# Altium schematic sheet RF Waveform Generator Schematic.SchDoc
size OrCAD D; SheetNumber: 1; SheetTotal: 1
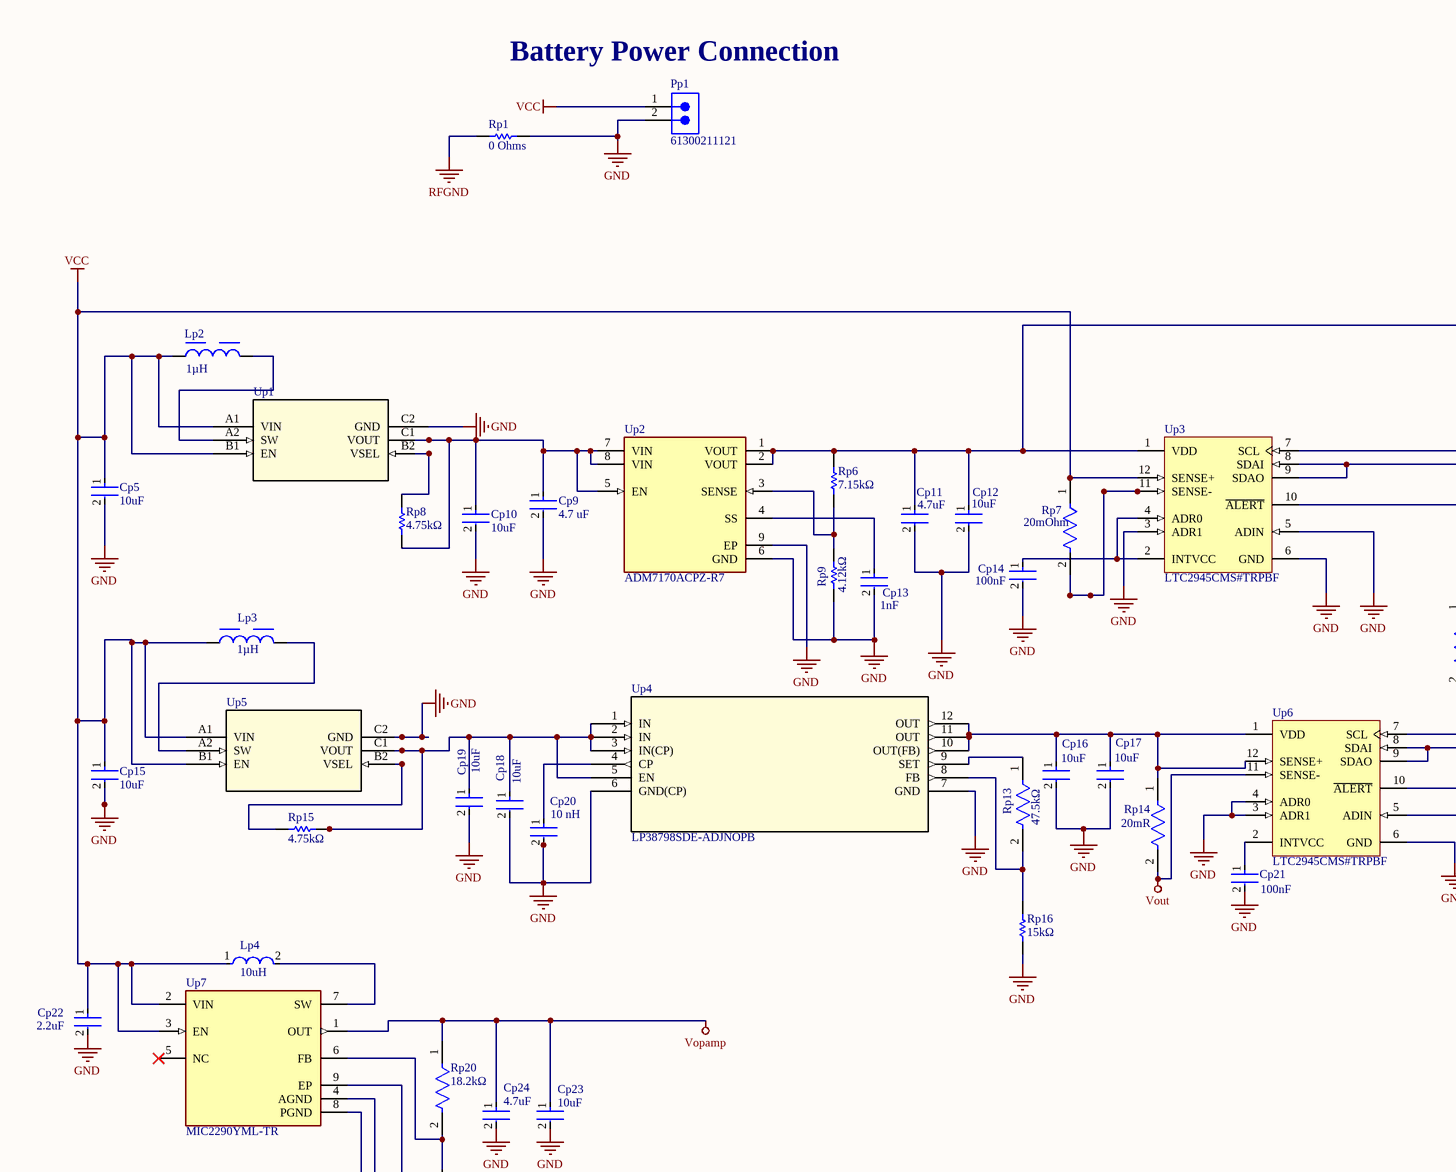
[diagram p0: RF Waveform Generator Schematic.SchDoc, top left]
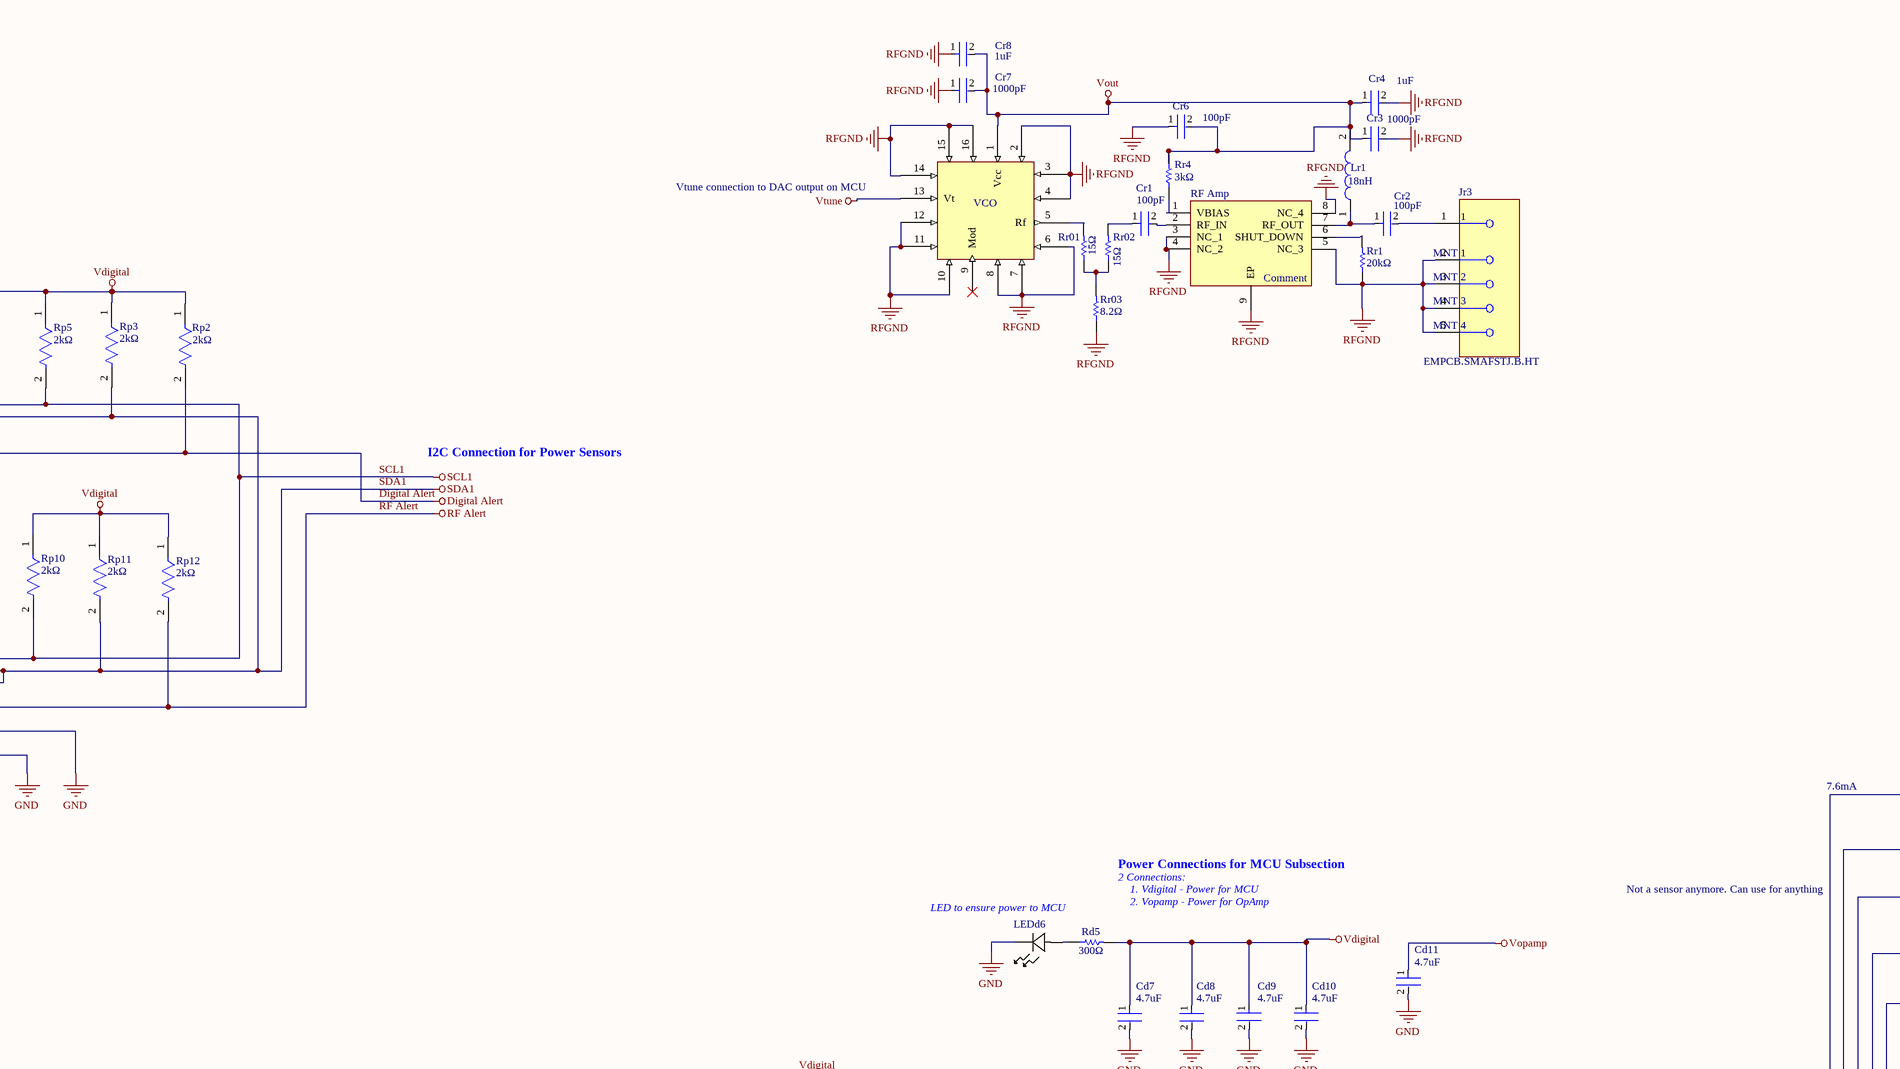
[diagram p1: RF Waveform Generator Schematic.SchDoc, top middle]
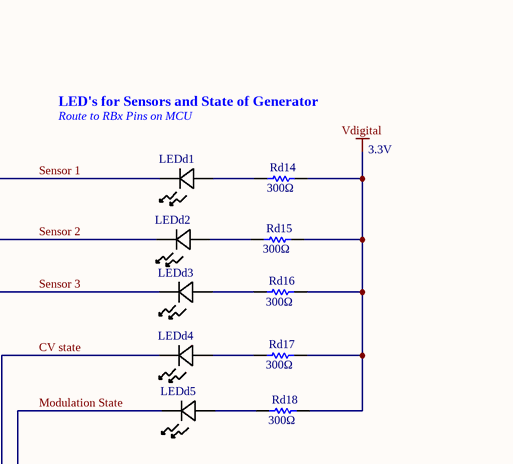
[diagram p2: RF Waveform Generator Schematic.SchDoc, top right]
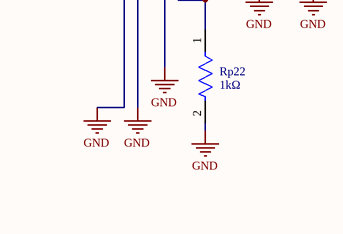
[diagram p3: RF Waveform Generator Schematic.SchDoc, bottom left]
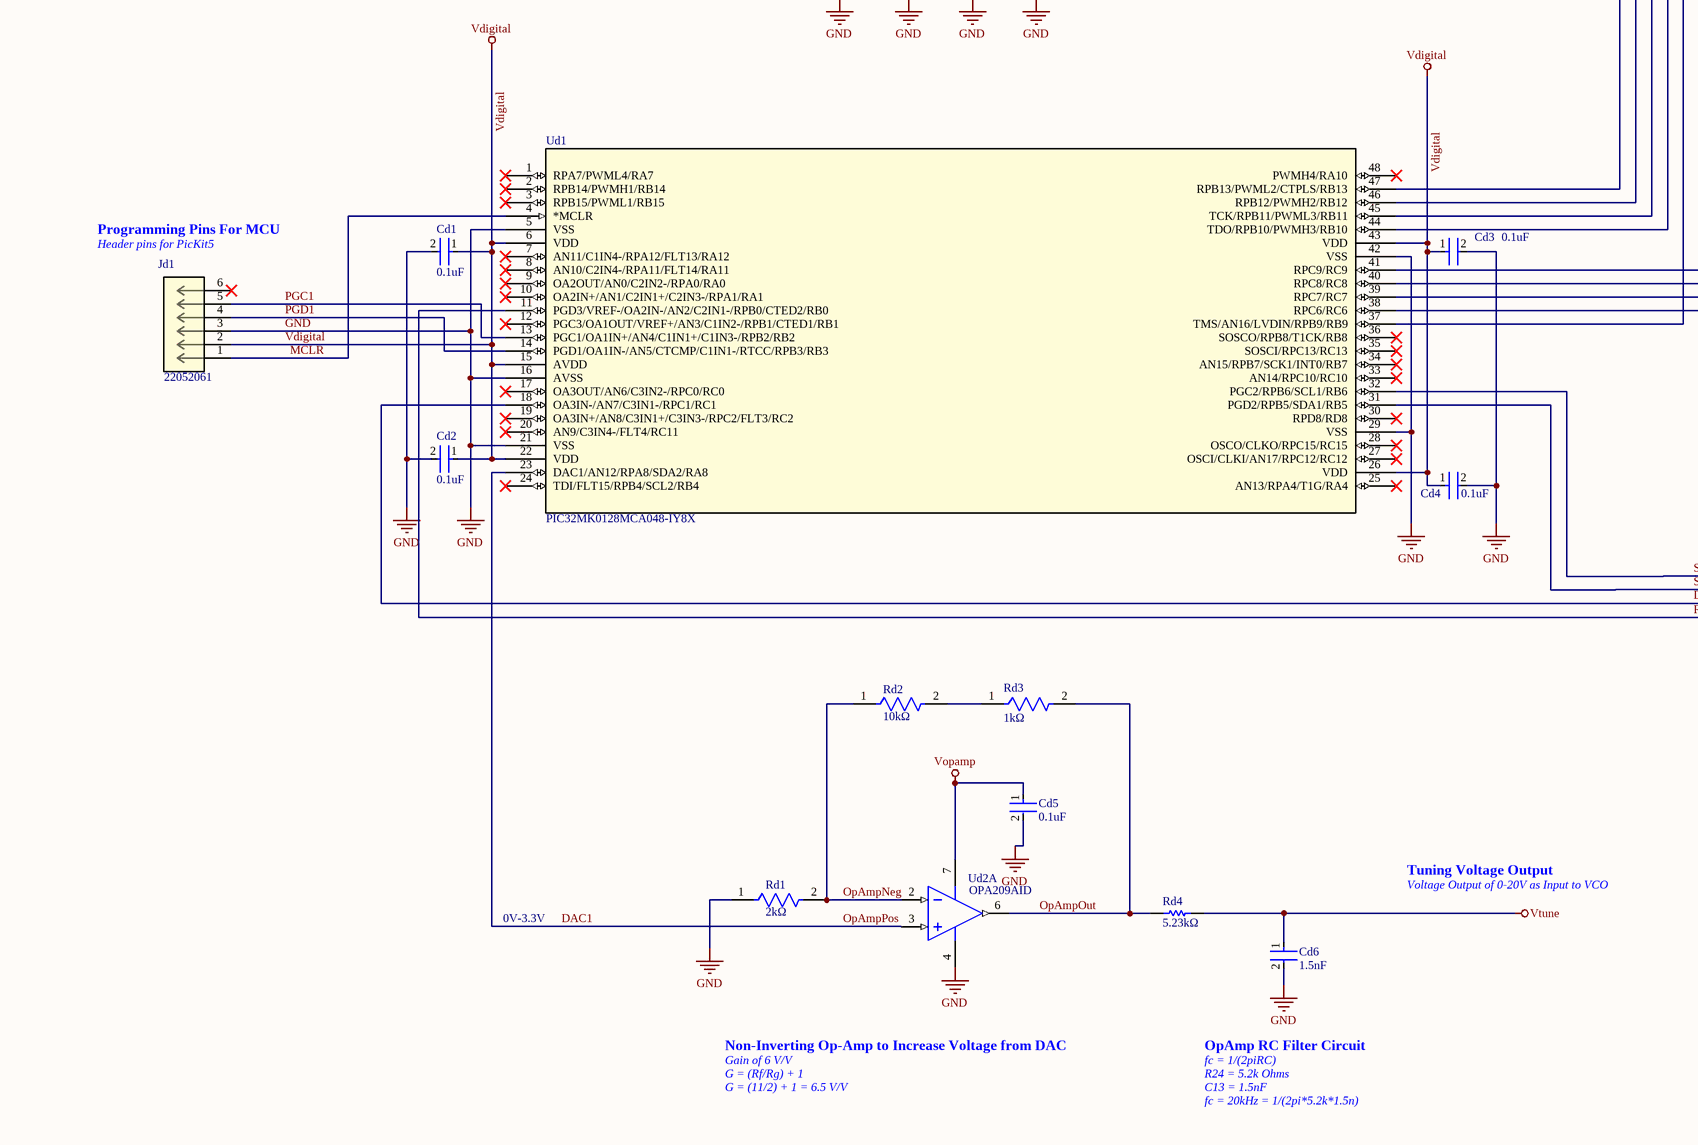
[diagram p4: RF Waveform Generator Schematic.SchDoc, bottom middle]
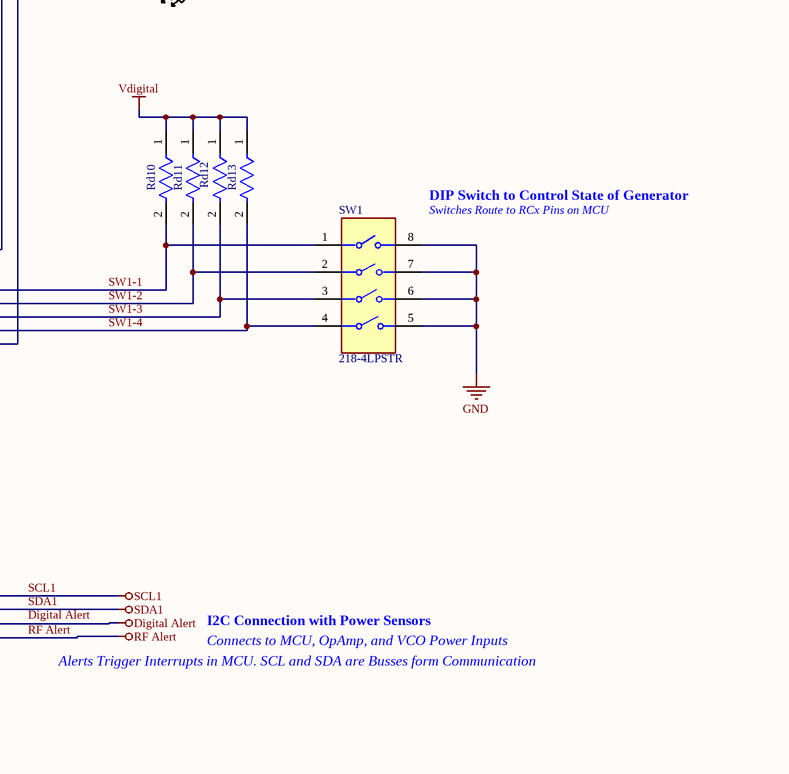
[diagram p5: RF Waveform Generator Schematic.SchDoc, bottom right]

## Parts
1  VCO  [VCO]
?  Component_1  (value not drawn)
Cd1  0.1uF  [FP-CC0402-MFG]
Cd2  0.1uF  [FP-CC0402-MFG]
Cd3  0.1uF  [FP-CC0402-MFG]
Cd4  0.1uF  [FP-CC0402-MFG]
Cd5  0.1uF  [FP-CC0402-MFG]
Cd6  1.5nF  [FP-CGA3E-0_3-0_1-MFG]
Cd7  4.7uF  [FP-GRM188-0_2-IPC_C]
Cd8  4.7uF  [FP-GRM188-0_2-IPC_C]
Cd9  4.7uF  [FP-GRM188-0_2-IPC_C]
Cd10  4.7uF  [FP-GRM188-0_2-IPC_C]
Cd11  4.7uF  [FP-GRM188-0_2-IPC_C]
Cp5  10uF  [FP-GRM188-0_2-IPC_C]
Cp9  4.7 uF  [FP-GRM188-0_2-IPC_A]
Cp10  10uF  [FP-GRM188-0_2-IPC_C]
Cp11  4.7uF  [FP-GRM188-0_2-IPC_A]
Cp12  10uF  [FP-GRM188-0_2-IPC_C]
Cp13  value 1nF  [FP-CC0402-MFG]  (hidden comment: CC0402KRX7R7BB102)
Cp14  Capacitance: 100nF  [FP-CC0402-MFG]  (hidden comment: CC0402KRX7R7BB104)
Cp15  10uF  [FP-GRM188-0_2-IPC_C]
Cp16  10uF  [FP-GRM188-0_2-IPC_C]
Cp17  10uF  [FP-GRM188-0_2-IPC_C]
Cp18  10uF  [FP-GRM188-0_2-IPC_C]
Cp19  10uF  [FP-GRM188-0_2-IPC_C]
Cp20  value 10 nH  [FP-C0402-BB-MFG]  (hidden comment: C0402C103K4RACTU)
Cp21  Capacitance: 100nF  [FP-CC0402-MFG]  (hidden comment: CC0402KRX7R7BB104)
Cp22  Capacitance: 2.2uF  [FP-GRM155-0_1-MFG]  (hidden comment: GRM155R61C225ME44D)
Cp23  10uF  [FP-GRM188-0_2-IPC_C]
Cp24  4.7uF  [FP-GRM188-0_2-IPC_A]
Cr1  100pF  [FP-C0402-BB-MFG]
Cr2  100pF  [FP-C0402-BB-MFG]
Cr3  1000pF  [FP-CC0402-MFG]
Cr4  1uF  [FP-CC0402-MFG]
Cr6  100pF  [FP-C0402-BB-MFG]
Cr7  1000pF  [FP-CC0402-MFG]
Cr8  1uF  [FP-CC0402-MFG]
Jd1  22052061  [CONN_22-05-2061_MOL]
Jr3  EMPCB.SMAFSTJ.B.HT  [FP-EMPCB_SMAFSTJ_B_HT-MFG]
LEDd1  XZCDGK54W-1VF  [LED_XZCDGK54W-1VF_SLD]  (value not drawn)
LEDd2  XZCDGK54W-1VF  [LED_XZCDGK54W-1VF_SLD]  (value not drawn)
LEDd3  XZCDGK54W-1VF  [LED_XZCDGK54W-1VF_SLD]  (value not drawn)
LEDd4  XZCDGK54W-1VF  [LED_XZCDGK54W-1VF_SLD]  (value not drawn)
LEDd5  XZCDGK54W-1VF  [LED_XZCDGK54W-1VF_SLD]  (value not drawn)
LEDd6  XZCDGK54W-1VF  [LED_XZCDGK54W-1VF_SLD]  (value not drawn)
Lp2  Inductance: 1µH  [WE-MAPI_2510]  (hidden comment: 74438323010)
Lp3  Inductance: 1µH  [WE-MAPI_2510]  (hidden comment: 74438323010)
Lp4  Inductance: 10uH  [FP-MLZ2012-1_25-MFG]  (hidden comment: MLZ2012N100LT000)
Lr1  18nH  [0603CS82NXGLW]
Pp1  61300211121  [61300211121]
Rd1  2kΩ  [FP-RC_L0402-MFG]
Rd2  10kΩ  [FP-AC0402-MFG]
Rd3  Resistance: 1kΩ  [FP-RC0402-0_4-IPC_A]  (hidden comment: RC0402FR-071KL)
Rd4  5.23kΩ  [RESC1005X40X25NL05T10]
Rd5  300Ω  [RESC1005X40X25LL05T10]
Rd10  AC0402FR-0710KL  [FP-AC0402-MFG]  (value not drawn)
Rd11  AC0402FR-0710KL  [FP-AC0402-MFG]  (value not drawn)
Rd12  AC0402FR-0710KL  [FP-AC0402-MFG]  (value not drawn)
Rd13  AC0402FR-0710KL  [FP-AC0402-MFG]  (value not drawn)
Rd14  300Ω  [RESC1005X40X25LL05T10]
Rd15  300Ω  [RESC1005X40X25LL05T10]
Rd16  300Ω  [RESC1005X40X25LL05T10]
Rd17  300Ω  [RESC1005X40X25LL05T10]
Rd18  300Ω  [RESC1005X40X25LL05T10]
RF_Amp  Comment
Rp1  0 Ohms  [RESC1005X40X25NL05T10]
Rp2  Resistance: 2kΩ  [FP-RC_L0402-MFG]  (hidden comment: RC0402FR-072KL)
Rp3  Resistance: 2kΩ  [FP-RC_L0402-MFG]  (hidden comment: RC0402FR-072KL)
Rp5  Resistance: 2kΩ  [FP-RC_L0402-MFG]  (hidden comment: RC0402FR-072KL)
Rp6  7.15kΩ  [RESC1005X40X25ML05T10]
Rp7  Resistance: 20mOhm  [FP-PE0402-0_5-MFG]  (hidden comment: PE0402JRF070R02L)
Rp8  4.75kΩ  [RESC1005X40X25LL05T10]
Rp9  4.12kΩ  [RESC1005X40X25ML05T10]
Rp10  Resistance: 2kΩ  [FP-RC_L0402-MFG]  (hidden comment: RC0402FR-072KL)
Rp11  Resistance: 2kΩ  [FP-RC_L0402-MFG]  (hidden comment: RC0402FR-072KL)
Rp12  Resistance: 2kΩ  [FP-RC_L0402-MFG]  (hidden comment: RC0402FR-072KL)
Rp13  Resistance: 47.5kΩ  [FP-RT0402-MFG]  (hidden comment: RT0402CRD0747K5L)
Rp14  Resistance: 20mR  [FP-PE0402-0_5-MFG]  (hidden comment: PE0402JRF070R02L)
Rp15  4.75kΩ  [RESC1005X40X25LL05T10]
Rp16  15kΩ  [RESC1005X40X25NL05T10]
Rp20  value 18.2kΩ  [FP-RT0402-MFG]  (hidden comment: RT0402DRE0718K2L)
Rp22  Resistance: 1kΩ  [FP-RC0402-0_4-IPC_A]  (hidden comment: RC0402FR-071KL)
Rr1  20kΩ  [RESC1005X40X25NL05T10]
Rr01  15Ω  [RESC1005X40X25LL05T10]
Rr02  15Ω  [RESC1005X40X25LL05T10]
Rr03  8.2Ω  [RESC1005X40X25LL05T10]
Rr4  3kΩ  [RESC1005X40X25LL10T10]
SW1  218-4LPSTR  [FP-218-4LPSTR-MFG]
Ud1  PIC32MK0128MCA048-IY8X  [TQFP48_Y8X_MCH]
Ud2  OPA209AID  [D0008A_N]  (part A of 2)
Up1  TPS61299YBHR  [Boost]  (value not drawn)
Up2  ADM7170ACPZ-R7  [FP-CP-8-21-IPC_C]
Up3  LTC2945CMS#TRPBF  [LT-MS-12_N]
Up4  LP38798SDE-ADJNOPB  [LDO]
Up5  TPS61299YBHR  [Boost]  (value not drawn)
Up6  LTC2945CMS#TRPBF  [LT-MS-12_N]
Up7  MIC2290YML-TR  [FP-DFN22-8LD-PL-1-IPC_A]

## Nets
Digital Alert: Rp2.2 Ud1.18(OA3IN-/AN7/C3IN1-/RPC1/RC1) Up3.10(~{ALERT})
GND: Cd1.2 Cd2.2 Cd3.2 Cd4.2 Cd5.2 Cd6.2 Cd7.2 Cd8.2 Cd9.2 Cd10.2 Cd11.2 Cp5.2 Cp9.2 Cp10.2 Cp11.2 Cp12.2 Cp13.2 Cp14.2 Cp15.2 Cp16.2 Cp17.2 Cp18.2 Cp19.2 Cp20.2 Cp21.2 Cp22.2 Cp23.2 Cp24.2 Jd1.3 LEDd6.1(CATHODE) Pp1.2 Rd1.1 Rp1.2 Rp9.1 Rp16.2 Rp22.2 SW1.5 SW1.6 SW1.7 SW1.8 Ud1.5(VSS) Ud1.16(AVSS) Ud1.21(VSS) Ud1.29(VSS) Ud1.42(VSS) Ud2.4(V-) Up1.C2(GND) Up2.6(GND) Up2.9(EP) Up3.3(ADR1) Up3.5(ADIN) Up3.6(GND) Up4.6(GND(CP)) Up4.7(GND) Up5.C2(GND) Up6.3(ADR1) Up6.4(ADR0) Up6.5(ADIN) Up6.6(GND) Up7.4(AGND) Up7.8(PGND) Up7.9(EP)
RF Alert: Rp12.2 Ud1.11(PGD3/VREF-/OA2IN-/AN2/C2IN1-/RPB0/CTED2/RB0) Up6.10(~{ALERT})
RFGND: 1.2 1.3 1.4 1.6 1.7 1.8 1.10 1.11 1.12 1.14 1.15 1.16 Cr3.2 Cr4.2 Cr6.1 Cr7.1 Cr8.1 Jr3.2(MNT_1) Jr3.3(MNT_2) Jr3.4(MNT_3) Jr3.5(MNT_4) RF_Amp.3(NC_1) RF_Amp.4(NC_2) RF_Amp.5(NC_3) RF_Amp.8(NC_4) RF_Amp.9(EP) Rp1.1 Rr1.1 Rr03.1
SCL1: Rp5.2 Rp10.2 Ud1.32(PGC2/RPB6/SCL1/RB6) Up3.7(SCL) Up6.7(SCL)
SDA1: Rp3.2 Rp11.2 Ud1.31(PGD2/RPB5/SDA1/RB5) Up3.8(SDAI) Up3.9(SDAO) Up6.8(SDAI) Up6.9(SDAO)
VCC: Cp5.1 Cp15.1 Cp22.1 Lp2.1 Lp3.1 Lp4.1 Pp1.1 Rp7.1 Up1.A1(VIN) Up1.B1(EN) Up3.12(SENSE+) Up5.A1(VIN) Up5.B1(EN) Up7.2(VIN) Up7.3(EN)
Vdigital: Cd1.1 Cd2.1 Cd3.1 Cd4.1 Cd7.1 Cd8.1 Cd9.1 Cd10.1 Cp11.1 Cp12.1 Jd1.2 Rd5.2 Rd10.1 Rd11.1 Rd12.1 Rd13.1 Rd14.2 Rd15.2 Rd16.2 Rd17.2 Rd18.2 Rp2.1 Rp3.1 Rp5.1 Rp6.2 Rp10.1 Rp11.1 Rp12.1 Ud1.6(VDD) Ud1.15(AVDD) Ud1.22(VDD) Ud1.26(VDD) Ud1.43(VDD) Up2.1(VOUT) Up2.2(VOUT) Up3.1(VDD)
Vopamp: Cd5.1 Cd11.1 Cp23.1 Cp24.1 Rp20.1 Ud2.7(V+) Up7.1(OUT)
Vout: 1.1(Vcc) Cr3.1 Cr4.1 Cr6.2 Cr7.2 Cr8.2 Lr1.2 Rp14.2 Rr4.2 Up6.11(SENSE-)
Vtune: 1.13(Vt) Cd6.1 Rd4.2
CV state: LEDd4.1(CATHODE) Ud1.44(TDO/RPB10/PWMH3/RB10)
DAC1: Ud1.23(DAC1/AN12/RPA8/SDA2/RA8) Ud2.3(IN+)  [also labelled OpAmpPos]
MCLR: Jd1.1 Ud1.4(*MCLR)
Modulation State: LEDd5.1(CATHODE) Ud1.37(TMS/AN16/LVDIN/RPB9/RB9)
OpAmpNeg: Rd1.2 Rd2.1 Ud2.2(IN-)
OpAmpOut: Rd3.2 Rd4.1 Ud2.6(OUT)
PGC1: Jd1.5 Ud1.13(PGC1/OA1IN+/AN4/C1IN1+/C1IN3-/RPB2/RB2)
PGD1: Jd1.4 Ud1.14(PGD1/OA1IN-/AN5/CTCMP/C1IN1-/RTCC/RPB3/RB3)
Sensor 1: LEDd1.1(CATHODE) Ud1.47(RPB13/PWML2/CTPLS/RB13)
Sensor 2: LEDd2.1(CATHODE) Ud1.46(RPB12/PWMH2/RB12)
Sensor 3: LEDd3.1(CATHODE) Ud1.45(TCK/RPB11/PWML3/RB11)
SW1-1: Rd10.2 SW1.1 Ud1.41(RPC9/RC9)
SW1-2: Rd11.2 SW1.2 Ud1.40(RPC8/RC8)
SW1-3: Rd12.2 SW1.3 Ud1.39(RPC7/RC7)
SW1-4: Rd13.2 SW1.4 Ud1.38(RPC6/RC6)
Net1_5: 1.5(Rf) Rr01.2
NetCp9_1: Cp9.1 Cp10.1 Rp8.2 Up1.C1(VOUT) Up2.5(EN) Up2.7(VIN) Up2.8(VIN)
NetCp13_1: Cp13.1 Up2.4(SS)
NetCp14_1: Cp14.1 Up3.2(INTVCC) Up3.4(ADR0)
NetCp16_1: Cp16.1 Cp17.1 Rp14.1 Up4.10(OUT(FB)) Up4.11(OUT) Up4.12(OUT) Up6.1(VDD) Up6.12(SENSE+)
NetCp18_1: Cp18.1 Cp19.1 Rp15.2 Up4.1(IN) Up4.2(IN) Up4.3(IN(CP)) Up4.5(EN) Up5.C1(VOUT)
NetCp20_1: Cp20.1 Up4.4(CP)
NetCp21_1: Cp21.1 Up6.2(INTVCC)
NetCr1_1: Cr1.1 Rr02.2
NetCr1_2: Cr1.2 RF_Amp.2(RF_IN)
NetCr2_1: Cr2.1 Lr1.1 RF_Amp.7(RF_OUT)
NetCr2_2: Cr2.2 Jr3.1
NetLEDd1_2: LEDd1.2(ANODE) Rd14.1
NetLEDd2_2: LEDd2.2(ANODE) Rd15.1
NetLEDd3_2: LEDd3.2(ANODE) Rd16.1
NetLEDd4_2: LEDd4.2(ANODE) Rd17.1
NetLEDd5_2: LEDd5.2(ANODE) Rd18.1
NetLEDd6_2: LEDd6.2(ANODE) Rd5.1
NetLp2_2: Lp2.2 Up1.A2(SW)
NetLp3_2: Lp3.2 Up5.A2(SW)
NetLp4_2: Lp4.2 Up7.7(SW)
NetRd2_2: Rd2.2 Rd3.1
NetRF_Amp_1: RF_Amp.1(VBIAS) Rr4.1
NetRF_Amp_6: RF_Amp.6(SHUT_DOWN) Rr1.2
NetRp6_1: Rp6.1 Rp9.2 Up2.3(SENSE)
NetRp7_2: Rp7.2 Up3.11(SENSE-)
NetRp8_1: Rp8.1 Up1.B2(VSEL)
NetRp13_1: Rp13.1 Up4.9(SET)
NetRp13_2: Rp13.2 Rp16.1 Up4.8(FB)
NetRp15_1: Rp15.1 Up5.B2(VSEL)
NetRp20_2: Rp20.2 Rp22.1 Up7.6(FB)
NetRr01_1: Rr01.1 Rr02.1 Rr03.2

Not connected (* = marked no-connect by the designer): 1 9(Mod)*; Jd1 6*; Ud1 1(RPA7/PWML4/RA7)* 2(RPB14/PWMH1/RB14)* 3(RPB15/PWML1/RB15)* 7(AN11/C1IN4-/RPA12/FLT13/RA12)* 8(AN10/C2IN4-/RPA11/FLT14/RA11)* 9(OA2OUT/AN0/C2IN2-/RPA0/RA0)* 10(OA2IN+/AN1/C2IN1+/C2IN3-/RPA1/RA1)* 12(PGC3/OA1OUT/VREF+/AN3/C1IN2-/RPB1/CTED1/RB1)* 17(OA3OUT/AN6/C3IN2-/RPC0/RC0)* 19(OA3IN+/AN8/C3IN1+/C3IN3-/RPC2/FLT3/RC2)* 20(AN9/C3IN4-/FLT4/RC11)* 24(TDI/FLT15/RPB4/SCL2/RB4)* 25(AN13/RPA4/T1G/RA4)* 27(OSCI/CLKI/AN17/RPC12/RC12)* 28(OSCO/CLKO/RPC15/RC15)* 30(RPD8/RD8)* 33(AN14/RPC10/RC10)* 34(AN15/RPB7/SCK1/INT0/RB7)* 35(SOSCI/RPC13/RC13)* 36(SOSCO/RPB8/T1CK/RB8)* 48(PWMH4/RA10)*; Up7 5(NC)*

## Notes on the sheet
- (near Pp1) Battery Power Connection
- Vtune connection to DAC output on MCU
- I2C Connection for Power Sensors
- Route to RBx Pins on MCU
- LED's for Sensors and State of Generator
- 3.3V
- 7.6mA
- 2 Connections:
- Power Connections for MCU Subsection
- 1. Vdigital - Power for MCU
- (near Rd5) 2. Vopamp - Power for OpAmp
- Not a sensor anymore. Can use for anything
- LED to ensure power to MCU
- (near SW1) DIP Switch to Control State of Generator
- (near Jd1) Programming Pins For MCU
- (near Jd1) Header pins for PicKit5
- (near SW1) Switches Route to RCx Pins on MCU
- Alerts Trigger Interrupts in MCU. SCL and SDA are Busses form Communication
- I2C Connection with Power Sensors
- Connects to MCU, OpAmp, and VCO Power Inputs
- 0V-3.3V
- Tuning Voltage Output
- Voltage Output of 0-20V as Input to VCO
- Non-Inverting Op-Amp to Increase Voltage from DAC
- Gain of 6 V/V
- fc = 1/(2piRC)
- OpAmp RC Filter Circuit
- G = (Rf/Rg) + 1
- G = (11/2) + 1 = 6.5 V/V
- fc = 20kHz = 1/(2pi*5.2k*1.5n)
- R24 = 5.2k Ohms
- C13 = 1.5nF
- Labels drawn without touching a wire or pin: Digital Alert

## Library data of the parts
Cd1-Cd5 = CMP-03422-000048-1: CC0402KRX7R7BB104, CAP CER 0.1UF 16V X7R 0402; Manufacturer: YAGEO; Automotive Grade: NA; Capacitance: 100 nF; Temperature Coefficient: 30ppm/°C; Tolerance: 0.1; Value: 100 nF; Device Class L1: Passive Components; Material: Ceramic; Temperature Range Low: -55°C; Device Class L3: Ceramic Capacitors; Temperature Characteristic: X7R; Ipc Land Pattern Name: CAPC10050X50; Temperature Range High: +125°C; Voltage Rating: 16 V; Temperature: -55°C to +125°C; RoHS: TRUE; Automotive: No; Height: 0.55mm; Device Class L2: Capacitors; Digikey Description: CAP CER 0.1UF 16V X7R 0402; Package: CC0402; Footprint Url: http://www.yageo.com/exep/pages/download/literatures/UPY-C_GEN_24.pdf; ComponentLink2Description: Datasheet; Category: Cap; Lead Free: Yes; Octopart: https://octopart.com/cc0402krx7r7bb104-yageo-42244624; ComponentLink2URL: http://www.yageo.com/documents/recent/UPY-GP_NP0_16V-to-50V_16.pdf; Manufacturer Part Number: CC0402KRX7R7BB104; Mouser Description: 0402 0.1 uF 16 V ±10 % Tolerance X7R SMT Multilayer Ceramic Capacitor
Cd6 = CMP-08246-001593-1: CGA3E2X5R1H152K080AA / Cap Ceramic 1.5nF 50V X5R 10% Pad SMD 0603 +85°C Automotive T/R; Case/Package: 0603; Capacitance: 1.5nF; Width: 0.031inch; Termination: SMD/SMT; Dielectric: X5R; Ratings: AEC-Q200; Package Quantity: 4000; Min Operating Temperature: -55°C; Case Code (Metric): 1608; Tolerance: 10%; Voltage Rating: 50V; Height: 0.8mm; Case Code (Imperial): 0603; Max Operating Temperature: 85°C; Length: 0.063inch; Packaging: Tape and Reel; Mount: Surface Mount; Weight: 7.1E-05oz; Thickness: 0.035inch; Voltage Rating (DC): 50V
Cd7-Cd11 = CMP-2006-02545-2: Chip Multilayer Ceramic Capacitors for General Purpose, 0603, 4.7uF, X5R, 15%, 10%, 35V; Lead Free: Lead Free; Max Operating Temperature: 85°C; Case Code (Imperial): 0603; Capacitance: 4.7uF; Width: 0.8mm; Thickness: 0.031inch; Case Code (Metric): 1608; Min Operating Temperature: -55°C; Voltage Rating (DC): 35V; Dielectric: X5R; Voltage: 35V; Packaging: Tape and Reel; Resistor Type: Ceramic; Weight: 0.000222oz; Mount: Surface Mount; Material: Ceramic; Depth: 0.8mm; Tolerance: 10%; REACH SVHC: No SVHC; Case/Package: 0603; Voltage Rating: 35V; Package Quantity: 4000; Height: 0.8mm; Length: 1.6mm; Termination: SMD/SMT
Cp5 Cp10 Cp12 Cp15-Cp19 Cp23 = CMP-06035-000049-2: Chip Multilayer Ceramic Capacitors for General Purpose, 0603, 10uF, X7R, 15%, 10%, 10V
Cp9 Cp11 Cp24 = CMP-06035-045467-1: Chip Multilayer Ceramic Capacitors for General Purpose, 0603, 4.7uF, X7R, 15%, 10%, 16V
Cp13 = CMP-2000-06070-2: CAP CER 1000PF 16V X7R 0402; Manufacturer: YAGEO; Tolerance: 0.1; Temperature Coefficient: 30ppm/°C; Automotive Grade: NA; Capacitance: 1.0 nF; Manufacturer Part Number: CC0402KRX7R7BB102; Automotive: No; ComponentLink2Description: Datasheet; Voltage Rating: 16 V; ComponentLink2URL: http://www.yageo.com/documents/recent/UPY-GP_NP0_16V-to-50V_16.pdf; Device Class L1: Passive Components; Lead Free: Yes; Temperature Range Low: -55°C; Package: CC0402; Ipc Land Pattern Name: CAPC10050X50; Mouser Description: 0402 1 nF 16 V ±10 % Tolerance X7R SMT Multilayer Ceramic Capacitor; Footprint Url: http://www.yageo.com/exep/pages/download/literatures/UPY-C_GEN_24.pdf; Temperature Range High: +125°C; Material: Ceramic; Category: Cap; Temperature: -55°C to +125°C; Octopart: https://octopart.com/cc0402krx7r7bb102-yageo-11543552; RoHS: TRUE; Device Class L3: Ceramic Capacitors; Height: 0.55mm; Device Class L2: Capacitors; Temperature Characteristic: X7R; Digikey Description: CAP CER 1000PF 16V X7R 0402
Cp14 Cp21 = CMP-03422-000048-1: CAP CER 0.1UF 16V X7R 0402; Manufacturer: YAGEO; Automotive Grade: NA; Temperature Coefficient: 30ppm/°C; Tolerance: 0.1; Value: 100 nF; Device Class L1: Passive Components; Material: Ceramic; Temperature Range Low: -55°C; Device Class L3: Ceramic Capacitors; Temperature Characteristic: X7R; Ipc Land Pattern Name: CAPC10050X50; Temperature Range High: +125°C; Voltage Rating: 16 V; Temperature: -55°C to +125°C; RoHS: TRUE; Automotive: No; Height: 0.55mm; Device Class L2: Capacitors; Digikey Description: CAP CER 0.1UF 16V X7R 0402; Package: CC0402; Footprint Url: http://www.yageo.com/exep/pages/download/literatures/UPY-C_GEN_24.pdf; ComponentLink2Description: Datasheet; Category: Cap; Lead Free: Yes; Octopart: https://octopart.com/cc0402krx7r7bb104-yageo-42244624; ComponentLink2URL: http://www.yageo.com/documents/recent/UPY-GP_NP0_16V-to-50V_16.pdf; Manufacturer Part Number: CC0402KRX7R7BB104; Mouser Description: 0402 0.1 uF 16 V ±10 % Tolerance X7R SMT Multilayer Ceramic Capacitor
Cp20 = CMP-2008-03072-2: CAP CER 10000PF 16V X7R 0402; Manufacturer: Kemet; Tolerance: 0.1; Capacitance: 10,000 pF; Temperature Coefficient: 15%; Package: C0402-BB; Height: 0.55mm; Temperature Range Low: -55°C; Lead Free: Yes; Material: Ceramic; Mouser Description: Capacitor; Ceramic; Cap; .010uF; Tol 10%; SMT; Vol-Rtg 16V; X7R; Tape and Reel; RoHS: TRUE; Device Class L3: Ceramic Capacitors; Voltage Rating: 16 V; Automotive: No; Temperature: -55°C to +125°C; Digikey Description: CAP CER 10000PF 16V X7R 0402; Temperature Characteristic: X7R; Temperature Range High: +125°C; Category: Cap; Ipc Land Pattern Name: CAPC10050X50; ComponentLink2URL: https://content.kemet.com/datasheets/KEM_C1002_X7R_SMD.pdf; Manufacturer Part Number: C0402C103K4RACTU; Octopart: https://octopart.com/c0402c103k4ractu-kemet-130896; ComponentLink2Description: Datasheet; Device Class L1: Passive Components; Device Class L2: Capacitors
Cp22 = CMP-06035-058929-1: Chip Multilayer Ceramic Capacitors for General Purpose, 0402, 2.2uF, X5R, 15%, 20%, 16V; Case/Package: 0402; Min Operating Temperature: -55°C; Tolerance: 20%; Width: 0.02inch; Height: 0.5mm; Package Quantity: 10000; Voltage Rating: 16V; Termination: SMD/SMT; Thickness: 0.024inch; Voltage Rating (DC): 16V; Weight: 0.000212oz; Max Operating Temperature: 85°C; Dielectric: X5R; Length: 0.039inch; Mount: Surface Mount; Case Code (Metric): 1005; Case Code (Imperial): 0402; Packaging: Tape and Reel
Cr1 Cr2 Cr6 = CMP-2008-03284-2: C0402C101J5GACTU, CAP CER 100PF 50V C0G/NP0 0402; Manufacturer: Kemet; Tolerance: 0.05; Temperature Characteristic: C0G; Temperature Coefficient: 15%; Material: Ceramic; Digikey Description: CAP CER 100PF 50V C0G/NP0 0402; Lead Free: Yes; Capacitance: 100 pF; Device Class L3: Ceramic Capacitors; Mouser Description: Multilayer Ceramic Capacitors MLCC - SMD/SMT 50volts 100pF C0G 5%; Octopart: https://octopart.com/c0402c101j5gactu-kemet-132471; Temperature Range Low: -55°C; Value: 100 pF; Automotive: No; Height: 0.55mm; Category: Cap; ComponentLink2URL: https://content.kemet.com/datasheets/KEM_C1002_X7R_SMD.pdf; Manufacturer Part Number: C0402C101J5GACTU; RoHS: TRUE; Ipc Land Pattern Name: CAPC10050X50; Temperature Range High: +125°C; Device Class L2: Capacitors; Package: C0402-BB; ComponentLink2Description: Datasheet; Temperature: -55°C to +125°C; Voltage Rating: 50 V; Device Class L1: Passive Components
Cr3 Cr7 = CMP-2000-06070-2: CC0402KRX7R7BB102, CAP CER 1000PF 16V X7R 0402; Manufacturer: YAGEO; Value: 1.0 nF; Tolerance: 0.1; Temperature Coefficient: 30ppm/°C; Automotive Grade: NA; Material: Ceramic; Manufacturer Part Number: CC0402KRX7R7BB102; Automotive: No; ComponentLink2Description: Datasheet; Voltage Rating: 16 V; ComponentLink2URL: http://www.yageo.com/documents/recent/UPY-GP_NP0_16V-to-50V_16.pdf; Device Class L1: Passive Components; Lead Free: Yes; Temperature Range Low: -55°C; Package: CC0402; Ipc Land Pattern Name: CAPC10050X50; Mouser Description: 0402 1 nF 16 V ±10 % Tolerance X7R SMT Multilayer Ceramic Capacitor; Footprint Url: http://www.yageo.com/exep/pages/download/literatures/UPY-C_GEN_24.pdf; Temperature Range High: +125°C; Category: Cap; Temperature: -55°C to +125°C; Octopart: https://octopart.com/cc0402krx7r7bb102-yageo-11543552; RoHS: TRUE; Capacitance: 1.0 nF; Device Class L3: Ceramic Capacitors; Height: 0.55mm; Device Class L2: Capacitors; Temperature Characteristic: X7R; Digikey Description: CAP CER 1000PF 16V X7R 0402
Cr4 Cr8 = CMP-03422-000489-1: CC0402KRX5R6BB105, CAP CER 1UF 10V X5R 0402; Manufacturer: YAGEO; Temperature Coefficient: 30ppm/°C; Tolerance: 0.1; Automotive Grade: NA; Material: Ceramic; Device Class L1: Passive Components; Ipc Land Pattern Name: CAPC10050X50; Height: 0.55mm; Voltage Rating: 10 V; Digikey Description: CAP CER 1UF 10V X5R 0402; RoHS: TRUE; Temperature: -55°C to +125°C; Octopart: https://octopart.com/cc0402krx5r6bb105-yageo-42244620; Mouser Description: Multilayer Ceramic Capacitors MLCC - SMD/SMT 1uF 10V X5R 10%; Manufacturer Part Number: CC0402KRX5R6BB105; Temperature Characteristic: X5R; Category: Cap; Automotive: No; Temperature Range Low: -55°C; Value: 1 uF; ComponentLink2Description: Datasheet; Temperature Range High: +125°C; Package: CC0402; Capacitance: 1 uF; Footprint Url: http://www.yageo.com/exep/pages/download/literatures/UPY-C_GEN_24.pdf; ComponentLink2URL: http://www.yageo.com/documents/recent/UPY-GP_NP0_16V-to-50V_16.pdf; Lead Free: Yes; Device Class L3: Ceramic Capacitors; Device Class L2: Capacitors
Jd1 = 22052061: No Description Available; Mfr_Name: Molex Connector Corporation; RefDes: RefDes; Type: Type
Jr3 = CMP-111093-000001-1: CONN SMA JACK STR 50OHM EDGE MNT; Manufacturer: Taoglas Limited; Conn Orientation: Horizontal; Frequency: 12.4GHz; Impedance: 50Ω; Voltage Rating: 335V; Is Female: yes; Pitch: 2.62mm; Number Of Contacts: 1; Device Class L2: RF / Coaxial Connectors; Category: Conn; Contact Material: Gold; Device Class L1: Connectors; Digikey Description: CONN SMA JACK STR 50OHM EDGE MNT; Temperature Range Low: -40°C; Octopart: https://octopart.com/empcb.smafstj.b.ht-taoglas-24204431; ComponentLink2URL: https://cdn.taoglas.com/datasheets/EMPCB.SMAFSTJ.B.HT.pdf; Temperature Range High: +85°C; Device Class L3: unset; Temperature: -40°C to +85°C; Package: 0; RoHS: TRUE; Lead Free: Yes; Automotive: No; ComponentLink2Description: Datasheet; Mouser Description: RF Connectors / Coaxial Connectors SMA Straight Edge Mount PCB Jack-Gold; Manufacturer Part Number: EMPCB.SMAFSTJ.B.HT
LEDd1-LEDd6 = XZCDGK54W-1VF: XZCDGK54W-1VF / LED GREEN CLEAR 0805 SMD; Mfr_Name: SunLED; Type: LED Indication
Lp2 Lp3 = CMP-1411-00009-3: NexarPartId: 30848142; Core Material: Composite, Ferrite, Metal; Series Resistance: 63mΩ; Tolerance: 20%; RMS Current (Irms): 2.5A; Self Resonant Frequency: 80MHz; Shielding: Shielded; Saturation Current: 4A; Test Frequency: 100kHz; Ambient Temperature Range High: 85°C; Packaging: Cut Tape (CT); Height: 1mm; Max Operating Temperature: 125°C; Length: 2.5mm; Height - Seated (Max): 990.6µm; Mount: Surface Mount; Depth: 2mm; DC Resistance (DCR): 63mΩ; Case/Package: 1008; REACH SVHC: Unknown; Termination: SMD/SMT; Weight: 32.006612mg; Ambient Temperature Range Low: -40°C; RoHS: Compliant; Max DC Current: 2.5A; Case Code (Imperial): 1008; Number of Pins: 2; Width: 2mm; Case Code (Metric): 2520; Current Rating: 2.5A; Inductance Tolerance: 20%; Min Operating Temperature: -40°C
Lp4 = CMP-08253-000052-1: Shielded Multilayer Inductor 10uH ±20% 500mA 390mΩ SMD 0805; Self Resonant Frequency: 50MHz; Core Material: Ferrite; Test Frequency: 2MHz; Saturation Current: 110mA; DC Resistance (DCR): 390mR; Current Rating: 500mA; Case Code (Metric): 2012; Package Quantity: 1; RoHS Compliant: Yes; Tolerance: 20%; Height - Seated (Max): 0.057inch; Case/Package: 0805; Width: 0.049inch; Mount: Surface Mount; Max Operating Temperature: 125°C; Packaging: Tape and Reel; Length: 0.079inch; Min Operating Temperature: -55°C; Case Code (Imperial): 0805; Shielding: Shielded
Lr1 = 0603CS-18NXJLW: Manufacturer_Name: COILCRAFT; Datasheet Link: https://www.coilcraft.com/pdfs/0603cs.pdf; Height: 1mm; Manufacturer_Part_Number: 0603CS-18NXJLW; Mouser Part Number: 994-0603CS-18NXJLW; Mouser Price/Stock: https://www.mouser.co.uk/ProductDetail/Coilcraft/0603CS-18NXJLW?qs=JVZp5BaCFzhI16sz%2FTNAfg%3D%3D
Pp1 = CMP-1712-00002-5: NexarPartId: 20081794; Operating Supply Voltage: 250V; Current Rating: 3A; Gender: Male; Number of Contacts: 2; Pitch: 2.54mm; Connector Type: Male Pin; Contact Resistance: 20mΩ; Contact Plating: Gold; Contact Material: Copper; Number of Pins: 2; Min Operating Temperature: -40°C; Packaging: Bulk; Lead Pitch: 2.54mm; Mount: Through Hole; Orientation: Vertical; RoHS: Compliant; REACH SVHC: No SVHC; Height: 8.94mm; Termination: Through Hole; Number of Positions: 2; Contact Mating Length: 5.9944mm; Color: Black; Contact Gender: Male; Number of Rows: 1; Housing Material: PBT; Lead Free: Lead Free; Voltage Rating: 250V; Max Operating Temperature: 125°C
Rd1 = CMP-2002-07580-2: RC0402FR-072KL, RES SMD 2K OHM 1% 1/16W 0402; Manufacturer: Yageo; Voltage Rating: 50V; Temperature Coefficient: 100ppm/°C; Power Rating: 0.0625W; Standoff Height: 0mm; Category: Res; Device Class L3: Chip SMD Resistors; Octopart: https://octopart.com/rc0402fr-072kl-yageo-5032519; Mouser Description: RES SMD 2K OHM 1% 1/16W 0402; RoHS: TRUE; Temperature: -55°C to +155°C; Device Class L2: Resistors; Series: RC_L; Automotive: No; Resistance: 2kΩ; Temperature Range Low: -55°C; Footprint Url: https://www.yageo.com/upload/website/yageo_PYu-R_Mount_10_19050818_343.pdf; Height: 0.4mm; ComponentLink2Description: Datasheet; Package: RC_L0402; ComponentLink2URL: http://www.yageo.com/documents/recent/PYu-RC_Group_51_RoHS_L_9.pdf; Manufacturer Part Number: RC0402FR-072KL; Temperature Range High: +155°C; Lead Free: Yes; Device Class L1: Passive Components; Ipc Land Pattern Name: RESC10050X35; Value: 2kΩ; Composition: Thick Film; Digikey Description: RES SMD 2K OHM 1% 1/16W 0402; Tolerance: 1%
Rd2 = CMP-2002-01790-3: AC0402FR-0710KL, RES 10kΩ ±1% 0.063W 0402; Power Rating: 62.5mW; Voltage Rating: 50V; Temperature Coefficient: 100ppm/°C; Resistance: 10kR; Max Power Dissipation: 63mW; Tolerance: 1%; Military Standard: Not; Construction: Rectangular; Termination: SMD/SMT; Max Operating Temperature: 155°C; Min Operating Temperature: -55°C; Height: 0.015inch; Lead Free: Lead Free; Width: 0.02inch; Case/Package: 0402; Resistor Type: Thick Film; Series: AC; Features: Moisture Resistant; RoHS Compliant: Yes; Number of Terminations: 2; Case Code (Metric): 1005; Length: 0.039inch; Depth: 0.5mm; Size Code: 0402; Packaging: Tape and Reel; Case Code (Imperial): 0402
Rd3 Rp22 = CMP-2002-07472-3: RES 1K OHM 1% 1/16W 0402; Max Power Dissipation: 63mW; Voltage Rating (DC): 50V; Temperature Coefficient: 100ppm/°C; Power Rating: 62.5mW; Technology: THICK FILM; Size Code: 0402; Series: RC; Length: 1mm; Case/Package: 0402; Features: Moisture Resistant; Termination: SMD/SMT; Case Code (Metric): 1005; Reach SVHC Compliant: Yes; Number of Terminations: 2; Tolerance: 1%; Lead Free: Lead Free; Military Standard: Not; Resistor Type: Thick Film; Max Operating Temperature: 155°C; RoHS Compliant: Yes; Construction: Rectangular; Voltage Rating: 50V; Packaging: Tape and Reel; Height: 0.32mm; Number of Pins: 2; Resistance Tolerance: 1%; Case Code (Imperial): 0402; Depth: 0.5mm; Min Operating Temperature: -55°C; Width: 0.5mm
Rd4 = CMP-2002-06960-1: RC0402FR-075K23L; Manufacturer: Yageo; Part Number: RC0402FR-075K23L
Rd5 Rd14-Rd18 = CMP-2002-07009-1: RC0402FR-07300RL; Manufacturer: Yageo / Phycomp; Part Number: RC0402FR-07300RL
Rd10-Rd13 = CMP-2002-01790-3: RES 10kΩ ±1% 0.063W 0402; Power Rating: 62.5mW; Voltage Rating: 50V; Temperature Coefficient: 100ppm/°C; Resistance: 10kR; Max Power Dissipation: 63mW; Tolerance: 1%; Military Standard: Not; Construction: Rectangular; Termination: SMD/SMT; Max Operating Temperature: 155°C; Min Operating Temperature: -55°C; Height: 0.015inch; Lead Free: Lead Free; Width: 0.02inch; Case/Package: 0402; Resistor Type: Thick Film; Series: AC; Features: Moisture Resistant; RoHS Compliant: Yes; Number of Terminations: 2; Case Code (Metric): 1005; Length: 0.039inch; Depth: 0.5mm; Size Code: 0402; Packaging: Tape and Reel; Case Code (Imperial): 0402
RF_Amp = TQL9093: Integrated Circuit; Manufacturer_Name: Qorvo; Datasheet Link: https://gr.mouser.com/datasheet/2/412/TQL9093_Data_Sheet-1500671.pdf; Height: 0.95mm; Manufacturer_Part_Number: TQL9093; Mouser Part Number: 772-TQL9093; Mouser Price/Stock: https://www.mouser.co.uk/ProductDetail/Qorvo/TQL9093?qs=zguNQ0T05GxQgIqSGHnBbQ%3D%3D
Rp1 = CMP-1011-00001-2: RC0402JR-070RL; Manufacturer: Yageo / Phycomp; Part Number: RC0402JR-070RL
Rp2 Rp3 Rp5 Rp10-Rp12 = CMP-2002-07580-2: RES SMD 2K OHM 1% 1/16W 0402; Manufacturer: Yageo; Voltage Rating: 50V; Temperature Coefficient: 100ppm/°C; Power Rating: 0.0625W; Standoff Height: 0mm; Value: 2kΩ; Category: Res; Device Class L3: Chip SMD Resistors; Octopart: https://octopart.com/rc0402fr-072kl-yageo-5032519; Mouser Description: RES SMD 2K OHM 1% 1/16W 0402; RoHS: TRUE; Temperature: -55°C to +155°C; Device Class L2: Resistors; Series: RC_L; Automotive: No; Temperature Range Low: -55°C; Footprint Url: https://www.yageo.com/upload/website/yageo_PYu-R_Mount_10_19050818_343.pdf; Height: 0.4mm; ComponentLink2Description: Datasheet; Package: RC_L0402; ComponentLink2URL: http://www.yageo.com/documents/recent/PYu-RC_Group_51_RoHS_L_9.pdf; Manufacturer Part Number: RC0402FR-072KL; Temperature Range High: +155°C; Lead Free: Yes; Device Class L1: Passive Components; Ipc Land Pattern Name: RESC10050X35; Composition: Thick Film; Digikey Description: RES SMD 2K OHM 1% 1/16W 0402; Tolerance: 1%
Rp6 = CMP-1011-00607-2: Part Number: RC0402FR-077K15L; Manufacturer: Yageo / Phycomp
Rp7 Rp14 = CMP-03412-037831-1: RES 0.02 OHM 5% 1/16W 0402; Temperature Coefficient: 100ppm/°C; Max Power Dissipation: 63mW; Resistor Type: Metal Film; Tolerance: 5%; Number of Terminations: 2; Max Operating Temperature: 125°C; Width: 0.02inch; RoHS Compliant: Yes; Length: 0.039inch; Height: 0.02inch; Min Operating Temperature: -55°C; Case/Package: 0402; Packaging: Tape and Reel; Features: Moisture Resistant
Rp8 Rp15 = CMP-2002-07714-1: Manufacturer: Yageo / Phycomp; Part Number: RC0402FR-074K75L
Rp9 = CMP-2002-07114-1: Part Number: RC0402FR-074K12L; Manufacturer: Yageo / Phycomp
Rp13 = CMP-03412-005080-1: RES SMD 47.5K OHM 1/16W 0402; Manufacturer: Yageo; Power Rating: 0.063W; Value: 47.5KΩ; Tolerance: 0.0025; Voltage Rating: 50V; Temperature Coefficient: 25 ppm/°C; ComponentLink2URL: http://www.yageo.com/documents/recent/PYu-RT_1-to-0.01_RoHS_L_9.pdf; Temperature: -55°C to +155°C; Height: 0.35mm; Composition: Thin Film; Series: RT; Footprint Url: http://www.yageo.com/exep/pages/download/literatures/PYu-R_Mount_10.pdf; RoHS: TRUE; Package: RT0402; Digikey Description: RES SMD 47.5K OHM 1/16W 0402; Lead Free: Yes; Category: Res; Device Class L2: Resistors; Device Class L1: Passive Components; Automotive: No; Device Class L3: Chip SMD Resistors; Octopart: https://octopart.com/rt0402crd0747k5l-yageo-1261837; Manufacturer Part Number: RT0402CRD0747K5L; Temperature Range Low: -55°C; Ipc Land Pattern Name: RESC10050X30; Temperature Range High: +155°C; ComponentLink2Description: Datasheet
Rp16 = CMP-2002-07410-1: Manufacturer: Yageo / Phycomp; Part Number: RC0402FR0715KL
Rp20 = CMP-03412-023673-1: RES SMD 18.2K OHM 0.5% 1/16W; Manufacturer: Yageo; Tolerance: 0.005; Voltage Rating: 50V; Power Rating: 0.063W; Temperature Coefficient: 50 ppm/°C; Footprint Url: http://www.yageo.com/exep/pages/download/literatures/PYu-R_Mount_10.pdf; Device Class L1: Passive Components; Temperature: -55°C to +155°C; Digikey Description: RES SMD 18.2K OHM 0.5% 1/16W; ComponentLink2URL: http://www.yageo.com/documents/recent/PYu-RT_1-to-0.01_RoHS_L_9.pdf; Resistance: 18.2KΩ; Height: 0.35mm; Device Class L2: Resistors; Automotive: No; Manufacturer Part Number: RT0402DRE0718K2L; Device Class L3: Chip SMD Resistors; RoHS: TRUE; Composition: Thin Film; Ipc Land Pattern Name: RESC10050X30; Temperature Range High: +155°C; Category: Res; Octopart: https://octopart.com/rt0402dre0718k2l-yageo-1187872; Package: RT0402; Temperature Range Low: -55°C; ComponentLink2Description: Datasheet; Lead Free: Yes; Mouser Description: Res Thin Film 0402 18.2K Ohm 0.5% 0.063W(1/16W) ±50ppm/C Epoxy Pad SMD T/R; Series: RT
Rr1 = CMP-2002-07956-1: RC0402JR-0720KL; Manufacturer: Yageo / Phycomp; Part Number: RC0402JR-0720KL
Rr01 Rr02 = CMP-2002-07413-1: RC0402FR-0715RL; Manufacturer: Yageo / Phycomp; Part Number: RC0402FR-0715RL
Rr03 = CMP-2002-08051-1: RC0402JR-078; Manufacturer: Yageo / Phycomp; Part Number: RC0402JR-0782RL
Rr4 = CMP-2002-05599-1: CR0402-JW-302GLF; Manufacturer: Bourns; Part Number: CR0402-JW-302GLF
SW1 = CMP-07018-000008-1: SWITCH SLIDE DIP SPST 25MA 24V; Number of Positions: 4; Washable: Yes; Pitch: 0.05inch; Actuator Type: Slide (Standard); Electrical Life: 1000Cycles; Current Rating: 25mA; Contact Material: Copper; Max Current Rating: 25mA; Termination: Gull Wing; Throw Configuration: SPST; Mount: Surface Mount; Radiation Hardening: No; Contact Plating: Gold; Length: 0.246inch; Depth: 8.44mm; Package Quantity: 2000; Packaging: Tape and Reel; Series: 218; Lead Free: Lead Free; Voltage Rating (DC): 24V; Min Operating Temperature: -55°C; RoHS Compliant: Yes; Mechanical Life: 1000Cycles; Max Operating Temperature: 85°C; Orientation: Straight; Max Voltage Rating (DC): 24V
Ud1 = PIC32MK0128MCA048-IY8X: No Description Available; Mfr_Name: Microchip; RefDes: RefDes; Type: Type
Ud2 = CMP-0272-00599-3: 2.2 nV/rtHz, 18 MHz, Precision, RRO, Operational Amplifier, 4.5 to 36 V, -40 to 125 degC, 8-pin SOIC (D8), Green (RoHS & no Sb/Br); Manufacturer: Texas Instruments; GBW(Typ)(MHz): 18; CMRR(Min)(dB): 120; Vio (25C)(Max)(mV): 0.15; Sub Family: High Supply Voltage Amplifier (>=30V), Low Noise Amp (<=10nV/rtHz), Low Offset Voltage Amplifier (<=500uV), Precision Amplifier; Slew Rate(Typ)(V/us): 6.4; Number of Channels: 1; Iq per channel(Max)(mA): 2.5; Total Supply Voltage(Max)(+5V is 5, +/-5V is 10): 36; Rating: Catalog; IIB(Max)(pA): 4500; Total Supply Voltage(Min)(+5V is 5, +/-5V is 10): 4.5; Packing: TUBE; ComponentLink1Description: Manufacturer URL; PackageVersion: 4040047-3/M, 06/2011; Eco-Plan: Green (RoHS & no Sb/Br); ComponentLink2Description: Datasheet; ComponentLink2URL: http://www.ti.com/lit/ds/symlink/opa209.pdf; Mounting Technology: Surface Mount; PackageReference: D0008A; ComponentLink3Description: Package Specification; ComponentLink1URL: http://www.ti.com/; ComponentLink3URL: http://www.ti.com/litv/pdf/msoi002j; PackageDescription: 8-Pin Plastic Small Outline, Body 4.9 x 3.9 mm, Pitch 1.27 mm; DatasheetVersion: SBOS426B; Offset Drift(Typ)(uV/C): 1; Code_JEDEC: MS-012; PartNumber: OPA209AID
Up1 Up5 = TPS61299YBHR: No Description Available; Mfr_Name: Texas Instruments; Type: Power Management; RefDes: RefDes
Up2 = CMP-09138-000077-1: IC REG LIN POS ADJ 500MA 8LFCSP; Power Supply Rejection Ratio (PSRR): 60dB; Quiescent Current: 2mA; Polarity: Positive; Min Current Limit: 700mA; Operating Supply Current: 3mA; Min Input Voltage: 2.3V; Output Type: Adjustable; Accuracy: 0.75%; Number of Outputs: 1; Output Voltage: 6.458V; Max Input Voltage: 6.5V; Input Bias Current: 1nA; Dropout Voltage: 42mV; Min Output Voltage: 1.2V; Number of Pins: 8; Max Operating Temperature: 125°C; Packaging: Tape and Reel; Mount: Surface Mount; REACH SVHC: No SVHC; Min Operating Temperature: -40°C; Max Output Current: 500mA; Number of Regulators: 1; Package Quantity: 1500; Lead Free: Contains Lead; RoHS Compliant: Yes; Output Current: 500mA
Up3 Up6 = CMP-0482-00798-1: Wide Range I2C Power Monitor, 12-pin SOP (MS-12), 0 to 70 degC, Pb-Free, Tape and Reel; Manufacturer: Linear Technology; Number of Supplies(#): 1; ComponentLink3Description: Package Specification; ComponentLink2URL: http://cds.linear.com/docs/en/datasheet/2945f.pdf; PackageReference: MS-12; PartNumber: LTC2945CMS#TRPBF; ComponentLink1URL: http://www.linear.com/; ComponentLink1Description: Manufacturer URL; RoHS: TRUE; PackageDescription: 12-Pin Plastic MSOP, Body 4.039 x 3 mm, Pitch 0.65 mm; Packing: Tape and Reel; PackageVersion: Rev. A, 05/2013; ComponentLink3URL: http://cds.linear.com/docs/en/packaging/05081668_A_MS12.pdf; Mounting Technology: Surface Mount; ComponentLink2Description: Datasheet
Up4 = LP38798SDE-ADJNOPB: No Description Available; Mfr_Name: Texas Instruments; RefDes: RefDes; Type: Type
Up7 = CMP-06325-000086-1: IC REG BOOST ADJ 750MA 8MLF; Switching Frequency-Max: 1.2MHz; Output Configuration: Positive; Min Supply Voltage: 2.5V; Synchronous Rectifier: No; Max Input Voltage: 10V; Output Current: 500mA; Max Output Voltage: 34V; Number of Outputs: 1; Output Type: Adjustable; Package Quantity: 5000; Max Output Current: 750mA; Min Operating Temperature: -40°C; Series: -; Mount: Surface Mount; Min Output Voltage: 2.5V; Min Input Voltage: 2.5V; Topology: Boost; Switching Frequency: 1.2MHz; Height: 0.85mm; Case/Package: DFN; Width: 2mm; Packaging: Cut Tape; Lead Free: Lead Free; Reach SVHC Compliant: Yes; RoHS Compliant: Yes; Number of Pins: 8; Output Voltage: 34V; Length: 2mm; Max Operating Temperature: 125°C